# EAGLE design VIC20_Diag_UP (EAGLE 9.5.2)
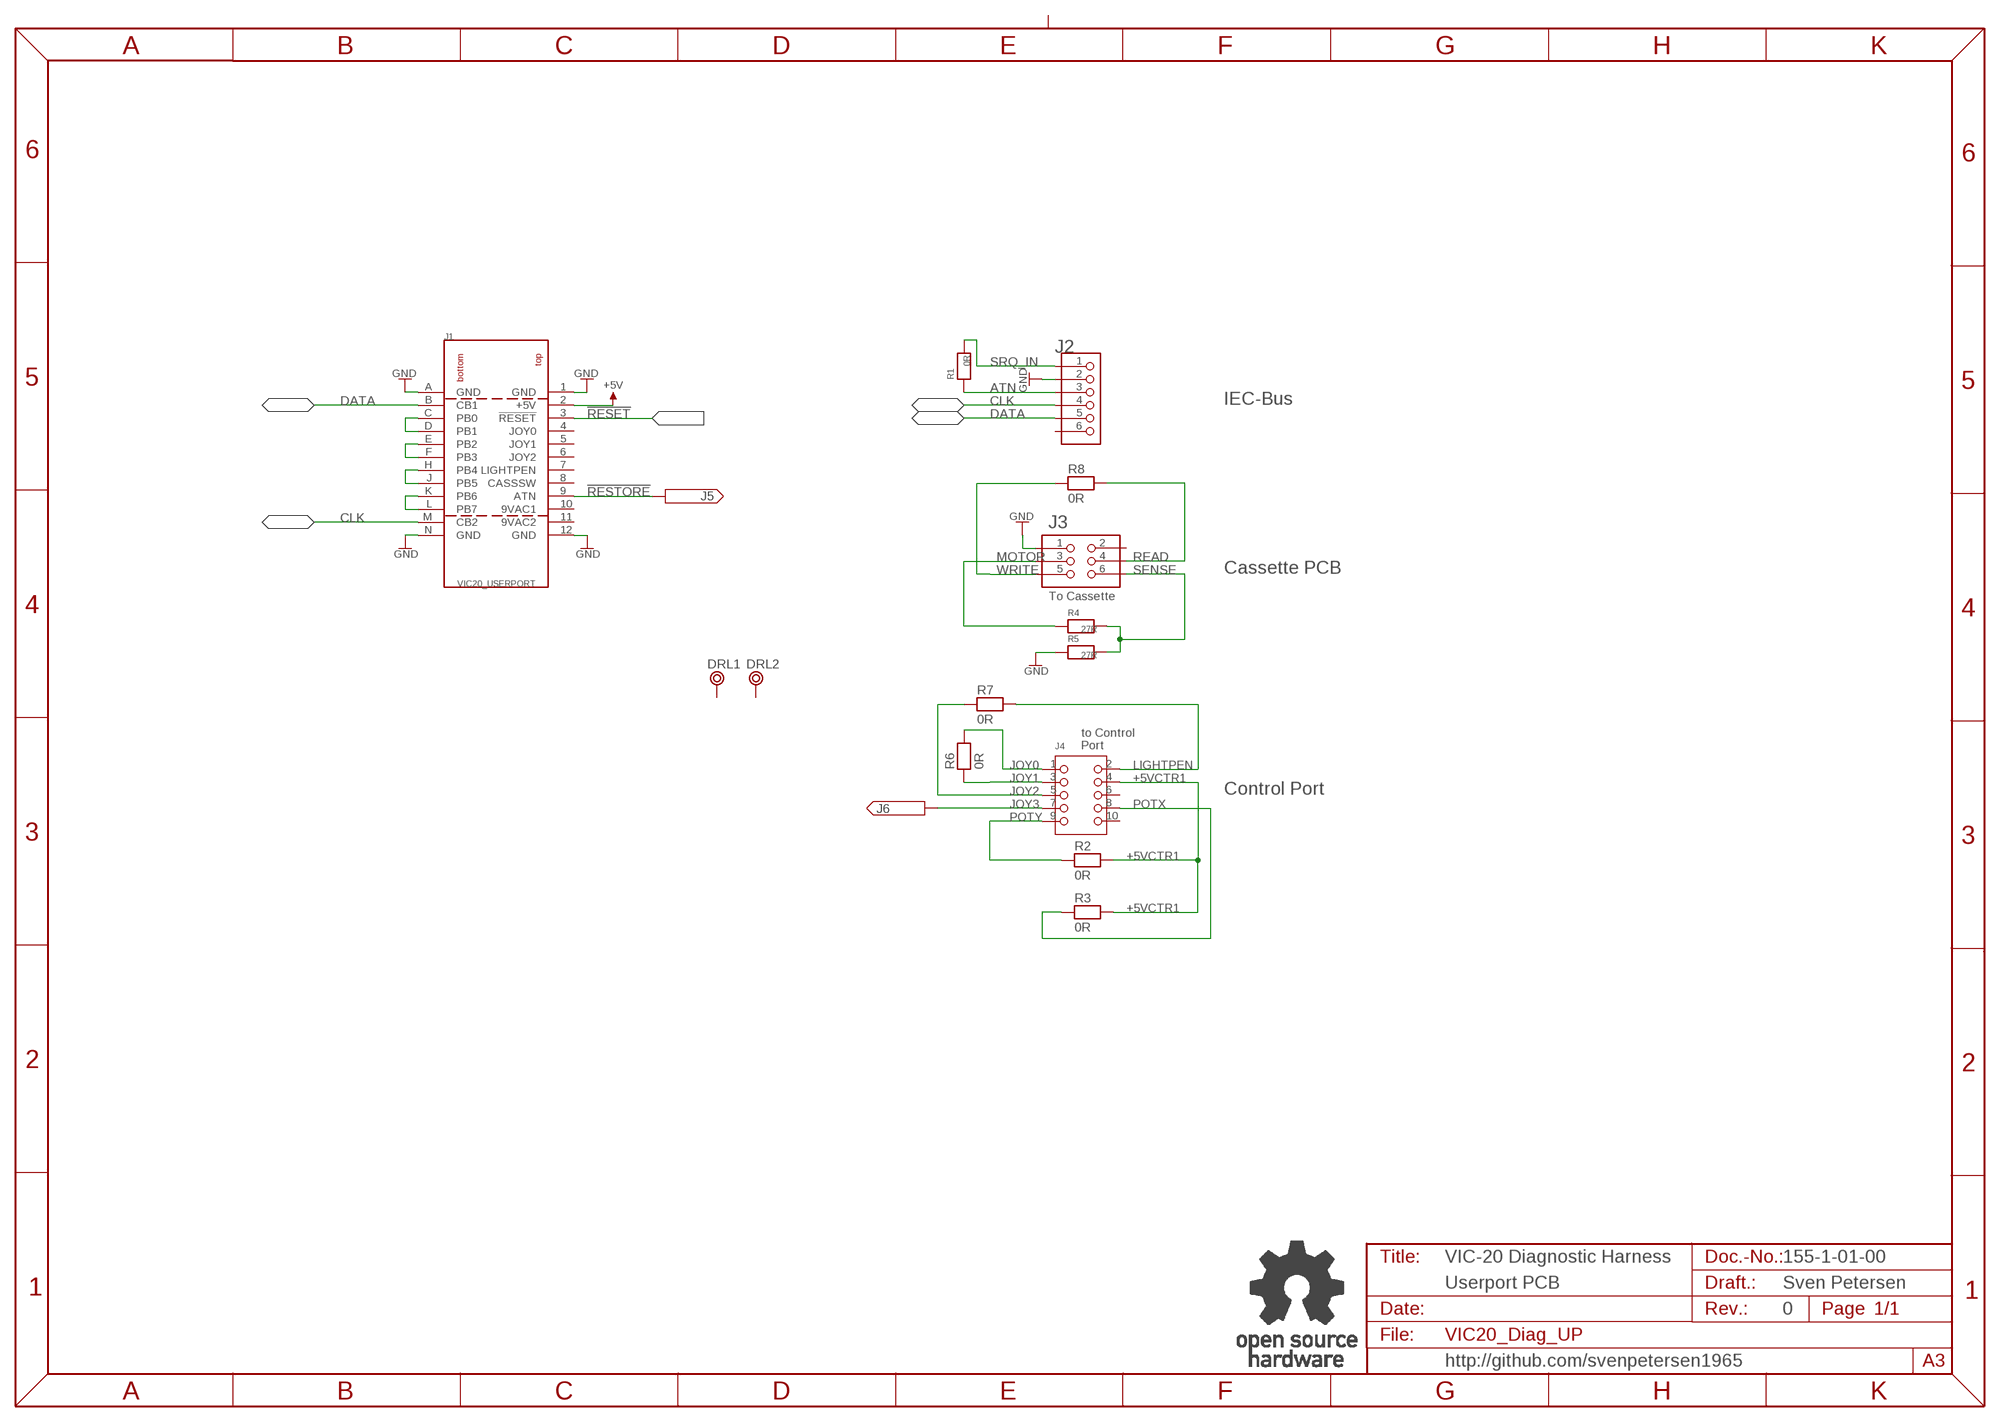
[diagram p0: schematic, sheet 1]

## Parts
DRL1  BOHR3,5  [BOHR3,5]
DRL2  BOHR3,5  [BOHR3,5]
J1  VIC20_USERPORT  [USERPORT]
J2  6410-6P  [6410-6P]
J3  2X03WV  [2X03WV]
J4  2X05WV  [2X05WV]
J5  PINHD-1X1  [1X01]
J6  PINHD-1X1  [1X01]
R1  0R  RES04  [R-10]
R2  0R  RES04  [R-10]
R3  0R  RES04  [R-10]
R4  27R  RES04  [R-10]
R5  27R  RES04  [R-10]
R6  0R  RES04  [R-10]
R7  0R  RES04  [R-10]
R8  0R  RES04  [R-10]
U$2  OPEN_SOURCE_HW  [OPENHW]

## Nets
!RESET: J1.3(!RESET)
!RESTORE: J1.9(ATN) J5.1
+5V: J1.2(+5V)
+5VCTR1: J4.4 R2.2 R3.2
ATN: J2.3 R1.1
CLK: J1.M(CB2) J2.4
DATA: J1.B(CB1) J2.5
GND: J1.1(GND) J1.12(GND) J1.A(GND) J1.N(GND) J2.2 J3.1 R5.1
JOY0: J4.1 R6.2
JOY1: J4.3 R6.1
JOY2: J4.5 R7.1
JOY3: J4.7 J6.1
LIGHTPEN: J4.2 R7.2
MOTOR: J3.3 R4.1
N$1: J1.C(PB0) J1.D(PB1)
N$2: J1.E(PB2) J1.F(PB3)
N$3: J1.H(PB4) J1.J(PB5)
N$4: J1.K(PB6) J1.L(PB7)
POTX: J4.8 R3.1
POTY: J4.9 R2.1
READ: J3.4 R8.2
SENSE: J3.6 R4.2 R5.2
SRQ_IN: J2.1 R1.2
WRITE: J3.5 R8.1
Unconnected: DRL1.P$1 DRL2.P$1 J1.4(JOY0) J1.5(JOY1) J1.6(JOY2) J1.7(LIGHTPEN) J1.8(CASSSW) J2.6 J3.2 J4.6 J4.10

## Notes on the sheet
- IEC-Bus
- Cassette PCB
- To Cassette
- to Control
  Port
- Control Port
- VIC-20 Diagnostic Harness | 155-1-01-00
- Userport PCB | Sven Petersen
- 0
- http://github.com/svenpetersen1965

## Power pins joined to a net without a drawn wire
9VAC1: J1.10(9VAC1)
9VAC2: J1.11(9VAC2)

## Library data of the parts
DRL1 DRL2 = Mech_Bohr:BOHR3,5
J1 = Commodore:VIC20_USERPORT
J2 = MOLEX:6410-6P: 6410/22-27-2061
J3 = PINHEAD:2X03WV
J4 = PINHEAD:2X05WV
J5 J6 = PINHEAD:PINHD-1X1
R1-R8 = DISCRETE:RES04
U$2 = Logo:OPEN_SOURCE_HW

## Board
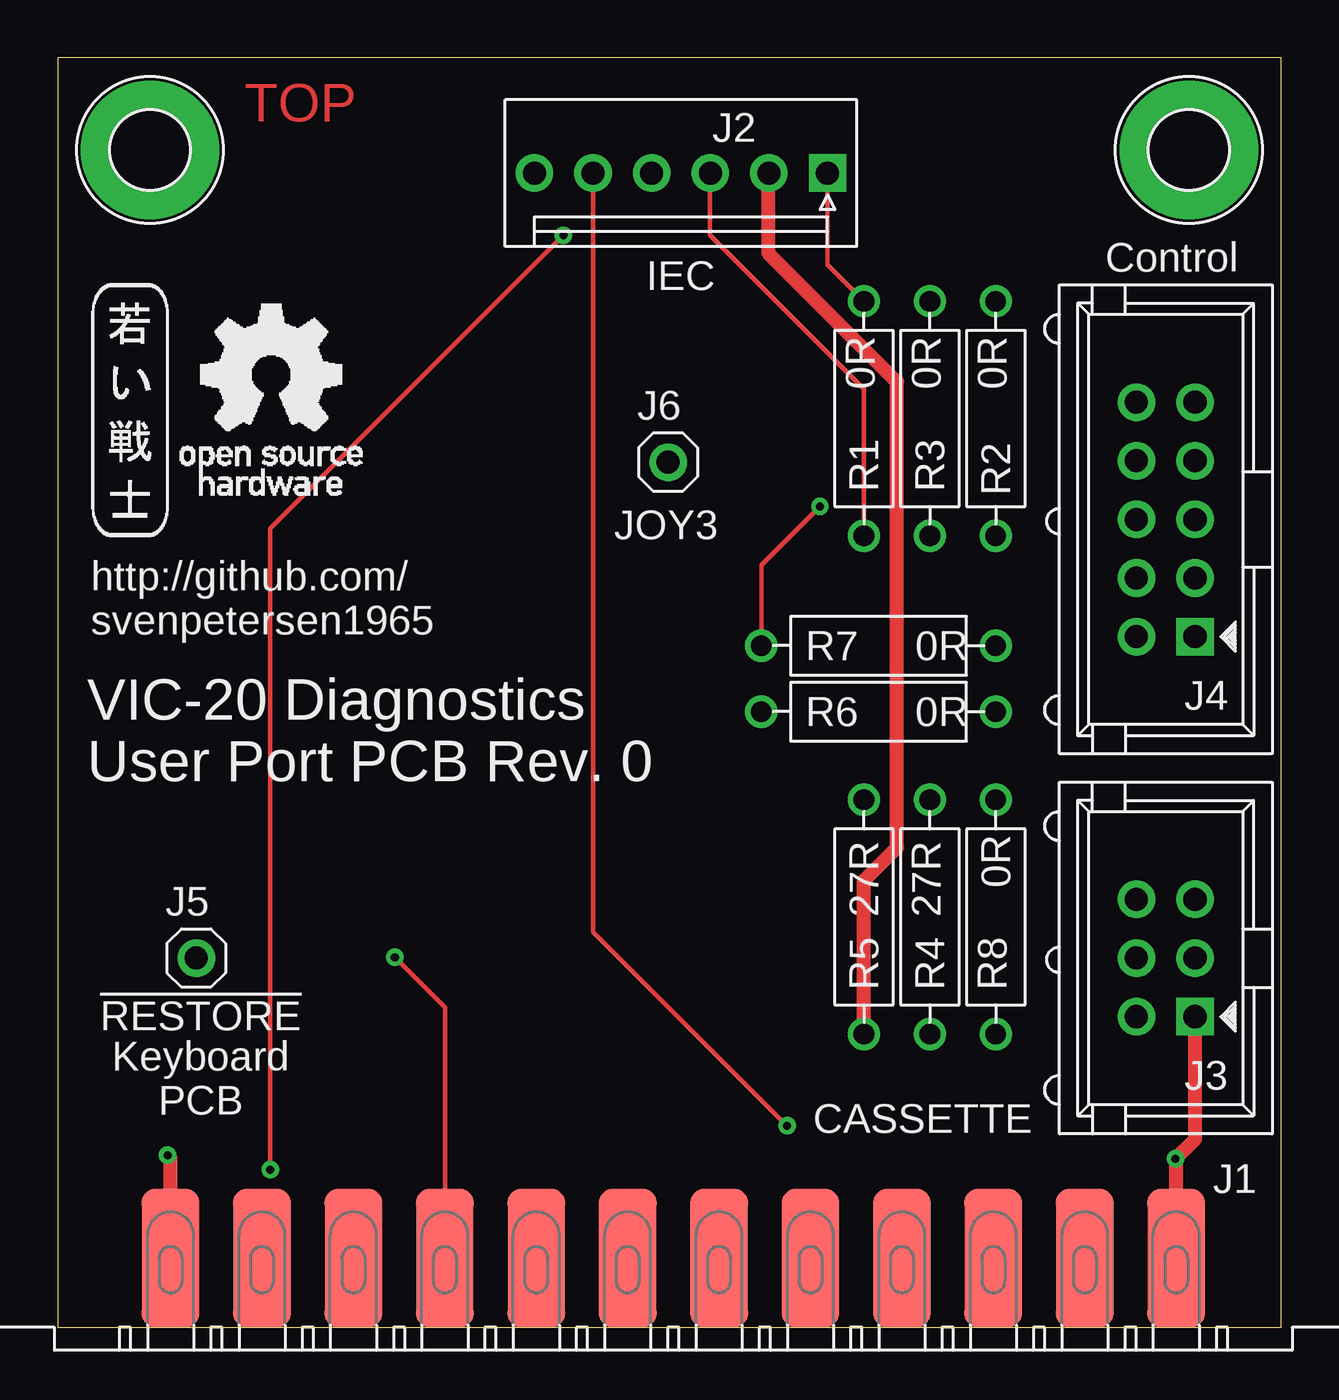
[diagram p1: board, top side]
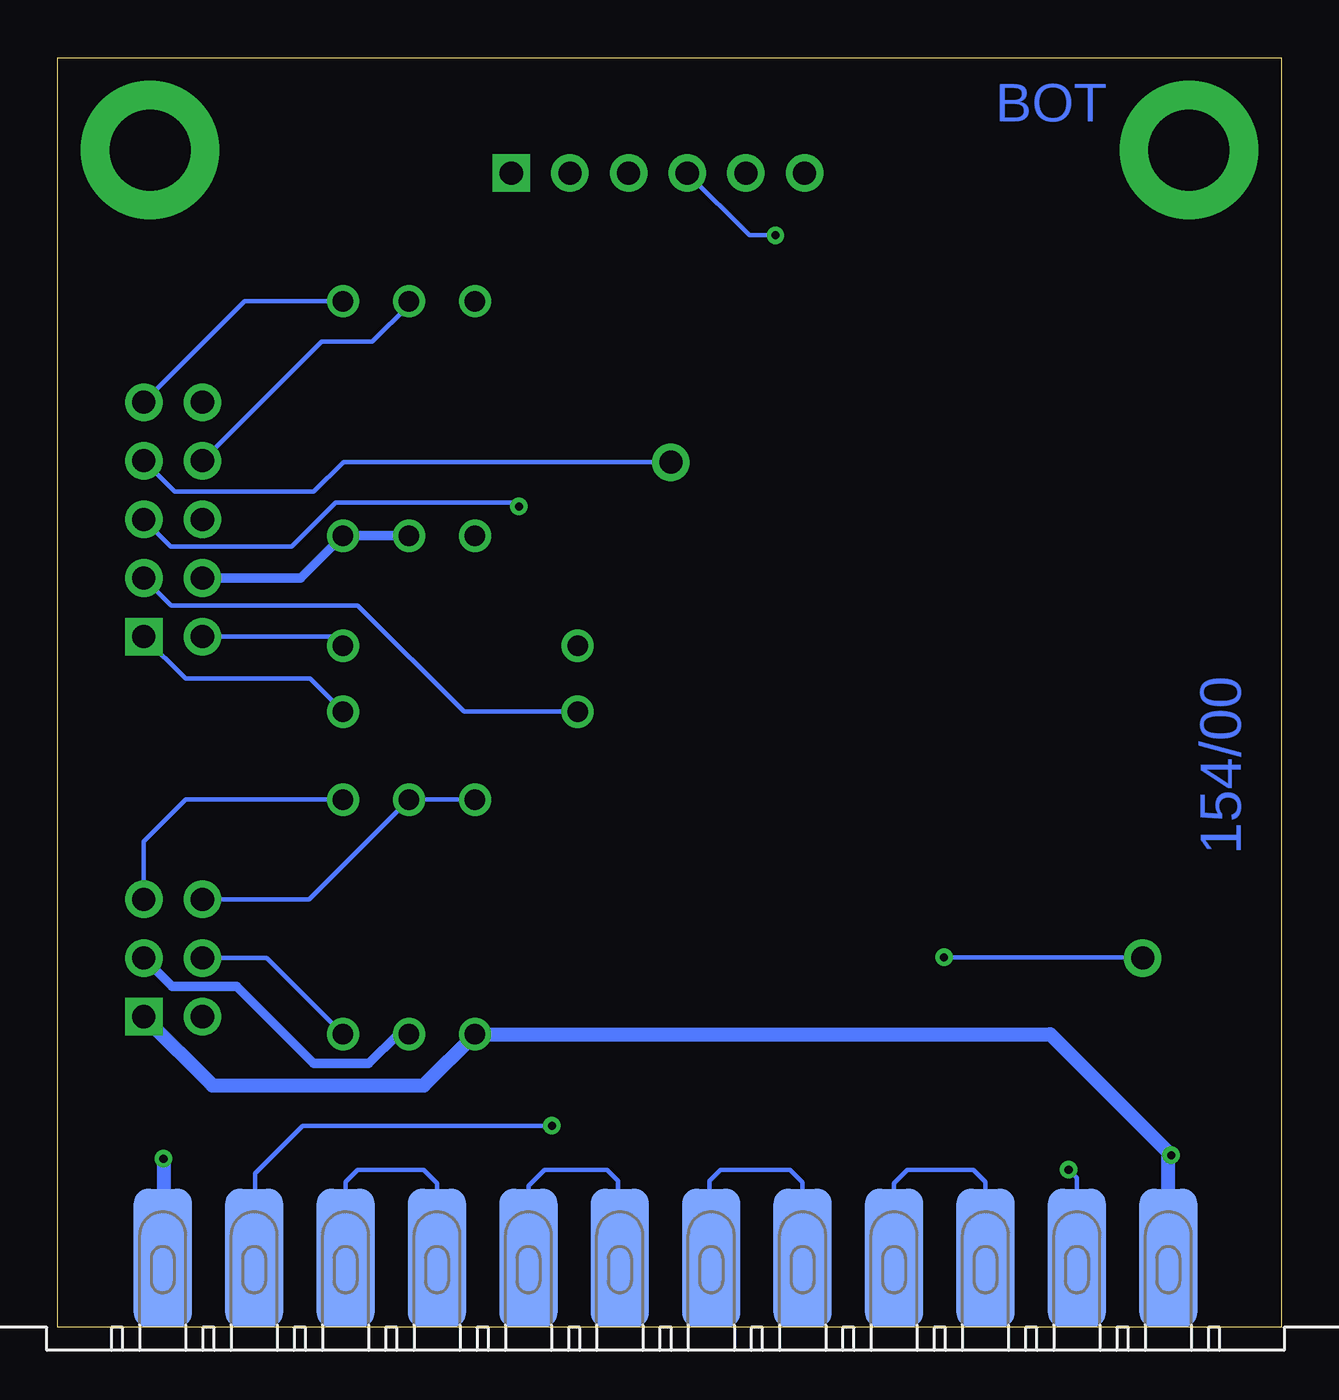
[diagram p2: board, bottom side, seen from below]

Size 53 x 55 mm. Coordinates in mm from the lower left corner, seen from the top.
Outline: 0,0 53,0 53,55 0.03,55 arc90 0,54.98 0,0
Copper layers (1*16): Top 0.035mm / dielectric 1.5mm / Bottom 0.035mm
Design rules "default *": minimum track width 6mil, minimum drill 0.35mm, track to track 6mil, track to pad 6mil, pad to pad 6mil, via to via 6mil, smd to smd 6mil, copper to edge 40mil, drill to drill 6mil, minimum pad ring 10mil, minimum via ring 8mil, stop-mask expansion 4mil, vias tented up to drill 25mil, thermal gap 10mil

### Footprints (pad centres in the part's own frame; a part is rotated, then mirrored left to right if it is on the bottom)
BOHR3,5 = drill 3.5 pad 6: P$1 0,0
USERPORT = smd 2.5 x 6: 1 -21.78,-3; 2 -17.82,-3; 3 -13.86,-3; 4 -9.9,-3; 5 -5.94,-3; 6 -1.98,-3; 7 1.98,-3; 8 5.94,-3; 9 9.9,-3; 10 13.86,-3; 11 17.82,-3; 12 21.78,-3 | smd 2.5 x 6 bottom: A -21.78,-3; B -17.82,-3; C -13.86,-3; D -9.9,-3; E -5.94,-3; F -1.98,-3; H 1.98,-3; J 5.94,-3; K 9.9,-3; L 13.86,-3; M 17.82,-3; N 21.78,-3
6410-6P = drill 1 pad 1.626 square: 1 -6.35,0 | drill 1 pad 1.626: 2 -3.81,0; 3 -1.27,0; 4 1.27,0; 5 3.81,0; 6 6.35,0
2X03WV = drill 1 pad 1.626 square: 1 -2.54,-1.27 | drill 1 pad 1.626: 2 -2.54,1.27; 3 0,-1.27; 4 0,1.27; 5 2.54,-1.27; 6 2.54,1.27
2X05WV = drill 1 pad 1.626 square: 1 -5.08,-1.27 | drill 1 pad 1.626: 2 -5.08,1.27; 3 -2.54,-1.27; 4 -2.54,1.27; 5 0,-1.27; 6 0,1.27; 7 2.54,-1.27; 8 2.54,1.27; 9 5.08,-1.27; 10 5.08,1.27
1X01 = drill 1 pad 1.626: 1 0,0
R-10 = drill 0.889 pad 1.397: 1 -5.08,0; 2 5.08,0

### Placement (x,y rotation side)
DRL1  4,51 0 top
DRL2  49,51 0 top
J1  26.67,0 180 top
J2  27,50 180 top
J3  48,16 90 top
J4  48,35 90 top
J5  6,16 0 top
J6  26.44,37.48 0 top
R1  34.92,39.37 90 top
R2  40.64,39.37 270 top
R3  37.78,39.37 270 top
R4  37.78,17.78 90 top
R5  34.92,17.78 90 top
R6  35.56,26.67 0 top
R7  35.56,29.53 0 top
R8  40.64,17.78 270 top
U$2  5.31,36.05 0 top
U$10  [SVEN_TAG]  3.17,39.85 0 top
U$17  [PCB-TITLE/]  0,63.5 0 top  (outside the outline)
U$18  [2LAYER]  8.1,52.23 0 top

### Tracks (layer width: path | path; a pad name or v marks a point on that pad's centre or on a via)
!RESTORE  (via drill 0.35)
  Top 0.203: J1.9 16.77,13.87 v14.61,16.03
  Bottom 0.203: v14.61,16.03 6.03,16.03 J5.1
+5VCTR1
  Bottom 0.406: J4.4 42.47,32.46 R2.2 R3.2
ATN
  Top 0.203: J2.3 28.26,49.99 28.26,47.31 34.92,40.64 R1.1
CLK  (via drill 0.35)
  Top 0.203: v9.21,6.83 9.21,34.61 v21.91,47.31
  Bottom 0.203: J1.M 8.85,6.47 v9.21,6.83 | v21.91,47.31 23.04,47.31 J2.4
DATA  (via drill 0.35)
  Top 0.203: v31.59,8.73 23.19,17.13 J2.5
  Bottom 0.203: J1.B 44.45,3.04 44.45,6.67 42.39,8.73 v31.59,8.73
GND  (via drill 0.35)
  Top 0.61: J1.1 48.45,7.27 v48.42,7.3 49.27,8.15 J3.1 | R5.1 34.92,19.37 36.35,20.8 36.35,40.96 30.8,46.51 30.8,49.99 J2.2 | 4.76,3.13 J1.N 4.89,7.33 v4.76,7.46
  Bottom 0.61: v48.42,7.3 48.42,3.03 J1.1 | J3.1 46.29,10.48 37.15,10.48 R5.1 10,12.7 v4.76,7.46 4.89,7.33 J1.N
JOY0
  Bottom 0.203: R6.2 42.07,28.1 47.47,28.1 49.27,29.9 J4.1
JOY1
  Bottom 0.203: R6.1 35.4,26.67 40.01,31.27 48.08,31.27 J4.3
JOY2  (via drill 0.35)
  Top 0.203: v33.02,35.56 30.48,33.02 R7.1
  Bottom 0.203: J4.5 49.27,34.98 48.1,33.81 42.86,33.81 40.96,35.72 33.18,35.72 v33.02,35.56
JOY3
  Bottom 0.203: J4.7 47.92,36.2 41.91,36.2 40.62,37.48 J6.1
LIGHTPEN
  Bottom 0.203: R7.2 41.03,29.92 J4.2
MOTOR
  Bottom 0.203: R4.1 38.26,12.7
  Bottom 0.406: 38.26,12.7 39.53,11.43 41.91,11.43 45.24,14.76 48.03,14.76 J3.3
N$1
  Bottom 0.203: J1.D 36.57,6.25 37.15,6.83 40.01,6.83 40.53,6.3 J1.C
N$2
  Bottom 0.203: J1.F 28.73,3.08 28.73,6.35 29.21,6.83 31.91,6.83 32.61,6.12 J1.E
N$3
  Bottom 0.203: J1.J 20.73,6.28 21.27,6.83 24.29,6.83 24.77,6.35 24.77,3.08 J1.H
N$4
  Bottom 0.203: J1.K 16.77,6.25 16.19,6.83 13.34,6.83 12.81,6.3 J1.L
POTX
  Bottom 0.203: J4.8 41.57,42.7 39.37,42.7 37.78,44.29 R3.1
POTY
  Bottom 0.203: J4.9 44.9,44.45 R2.1
READ
  Bottom 0.203: R8.2 43.94,16 J3.4
SENSE
  Bottom 0.203: J3.6 42.1,18.54 R4.2 R5.2
SRQ_IN
  Top 0.203: R1.2 33.35,46.02 J2.1
WRITE
  Bottom 0.203: R8.1 47.47,22.86 49.27,21.06 J3.5

### Text on the board
Bottom: 154/00
tPlace: Control | IEC | 0R | 0R | 0R | JOY3 | http://github.com/ / svenpetersen1965 | 0R | 0R | VIC-20 Diagnostics / User Port PCB Rev. 0 | 0R | 27R | 27R | !RESTORE | Keyboard / PCB | CASSETTE
Document: 154-2-01-00 | Sven Petersen / 2020 | 35µm | 2 | 0